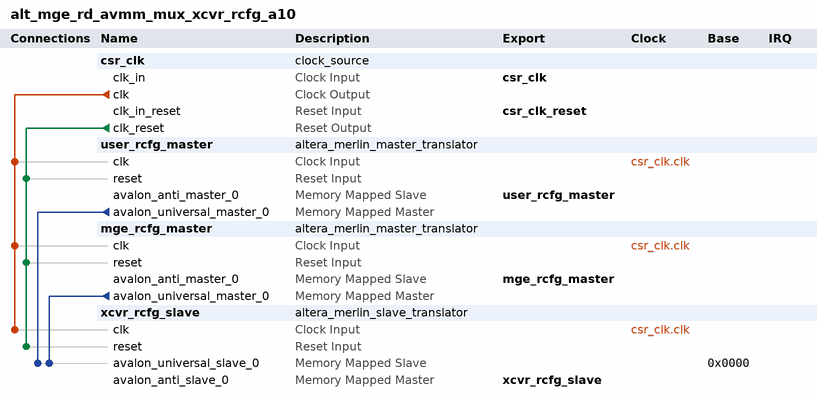
[diagram p0: system contents]
# Platform Designer (Qsys) system alt_mge_rd_avmm_mux_xcvr_rcfg_a10, Arria 10 10AX115S4F45I3SG
# Parameters at their usual value, and those the tool derives, are not listed.
package require -exact qsys 15.0
create_system alt_mge_rd_avmm_mux_xcvr_rcfg_a10
set_project_property DEVICE_FAMILY {Arria 10}
set_project_property DEVICE 10AX115S4F45I3SG

add_instance csr_clk clock_source 15.0
set_instance_parameter_value csr_clk clockFrequency 125000000

add_instance user_rcfg_master altera_merlin_master_translator 15.0
set_instance_parameter_value user_rcfg_master AV_ADDRESSGROUP 0
set_instance_parameter_value user_rcfg_master AV_ADDRESS_SYMBOLS 0
set_instance_parameter_value user_rcfg_master AV_ADDRESS_W 10
set_instance_parameter_value user_rcfg_master AV_ALWAYSBURSTMAXBURST 0
set_instance_parameter_value user_rcfg_master AV_BITS_PER_SYMBOL 8
set_instance_parameter_value user_rcfg_master AV_BURSTBOUNDARIES 0
set_instance_parameter_value user_rcfg_master AV_BURSTCOUNT_SYMBOLS 1
set_instance_parameter_value user_rcfg_master AV_BURSTCOUNT_W 3
set_instance_parameter_value user_rcfg_master AV_BYTEENABLE_W 4
set_instance_parameter_value user_rcfg_master AV_CONSTANT_BURST_BEHAVIOR 0
set_instance_parameter_value user_rcfg_master AV_DATA_HOLD 0
set_instance_parameter_value user_rcfg_master AV_DATA_W 32
set_instance_parameter_value user_rcfg_master AV_INTERLEAVEBURSTS 0
set_instance_parameter_value user_rcfg_master AV_ISBIGENDIAN 0
set_instance_parameter_value user_rcfg_master AV_LINEWRAPBURSTS 0
set_instance_parameter_value user_rcfg_master AV_MAX_PENDING_READ_TRANSACTIONS 0
set_instance_parameter_value user_rcfg_master AV_READLATENCY 0
set_instance_parameter_value user_rcfg_master AV_READ_WAIT 0
set_instance_parameter_value user_rcfg_master AV_REGISTERINCOMINGSIGNALS 0
set_instance_parameter_value user_rcfg_master AV_REGISTEROUTGOINGSIGNALS 0
set_instance_parameter_value user_rcfg_master AV_SETUP_WAIT 0
set_instance_parameter_value user_rcfg_master AV_SYMBOLS_PER_WORD 4
set_instance_parameter_value user_rcfg_master AV_WRITE_WAIT 0
set_instance_parameter_value user_rcfg_master UAV_ADDRESSGROUP 0
set_instance_parameter_value user_rcfg_master UAV_ADDRESS_W 12
set_instance_parameter_value user_rcfg_master UAV_BURSTCOUNT_W 3
set_instance_parameter_value user_rcfg_master UAV_CONSTANT_BURST_BEHAVIOR 0
set_instance_parameter_value user_rcfg_master USE_ADDRESS 1
set_instance_parameter_value user_rcfg_master USE_BEGINBURSTTRANSFER 0
set_instance_parameter_value user_rcfg_master USE_BEGINTRANSFER 0
set_instance_parameter_value user_rcfg_master USE_BURSTCOUNT 0
set_instance_parameter_value user_rcfg_master USE_BYTEENABLE 0
set_instance_parameter_value user_rcfg_master USE_CHIPSELECT 0
set_instance_parameter_value user_rcfg_master USE_CLKEN 0
set_instance_parameter_value user_rcfg_master USE_DEBUGACCESS 0
set_instance_parameter_value user_rcfg_master USE_LOCK 0
set_instance_parameter_value user_rcfg_master USE_READ 1
set_instance_parameter_value user_rcfg_master USE_READDATA 1
set_instance_parameter_value user_rcfg_master USE_READDATAVALID 0
set_instance_parameter_value user_rcfg_master USE_READRESPONSE 0
set_instance_parameter_value user_rcfg_master USE_WAITREQUEST 1
set_instance_parameter_value user_rcfg_master USE_WRITE 1
set_instance_parameter_value user_rcfg_master USE_WRITEDATA 1
set_instance_parameter_value user_rcfg_master USE_WRITERESPONSE 0

add_instance mge_rcfg_master altera_merlin_master_translator 15.0
set_instance_parameter_value mge_rcfg_master AV_ADDRESSGROUP 0
set_instance_parameter_value mge_rcfg_master AV_ADDRESS_SYMBOLS 0
set_instance_parameter_value mge_rcfg_master AV_ADDRESS_W 10
set_instance_parameter_value mge_rcfg_master AV_ALWAYSBURSTMAXBURST 0
set_instance_parameter_value mge_rcfg_master AV_BITS_PER_SYMBOL 8
set_instance_parameter_value mge_rcfg_master AV_BURSTBOUNDARIES 0
set_instance_parameter_value mge_rcfg_master AV_BURSTCOUNT_SYMBOLS 1
set_instance_parameter_value mge_rcfg_master AV_BURSTCOUNT_W 3
set_instance_parameter_value mge_rcfg_master AV_BYTEENABLE_W 4
set_instance_parameter_value mge_rcfg_master AV_CONSTANT_BURST_BEHAVIOR 0
set_instance_parameter_value mge_rcfg_master AV_DATA_HOLD 0
set_instance_parameter_value mge_rcfg_master AV_DATA_W 32
set_instance_parameter_value mge_rcfg_master AV_INTERLEAVEBURSTS 0
set_instance_parameter_value mge_rcfg_master AV_ISBIGENDIAN 0
set_instance_parameter_value mge_rcfg_master AV_LINEWRAPBURSTS 0
set_instance_parameter_value mge_rcfg_master AV_MAX_PENDING_READ_TRANSACTIONS 0
set_instance_parameter_value mge_rcfg_master AV_READLATENCY 0
set_instance_parameter_value mge_rcfg_master AV_READ_WAIT 0
set_instance_parameter_value mge_rcfg_master AV_REGISTERINCOMINGSIGNALS 0
set_instance_parameter_value mge_rcfg_master AV_REGISTEROUTGOINGSIGNALS 0
set_instance_parameter_value mge_rcfg_master AV_SETUP_WAIT 0
set_instance_parameter_value mge_rcfg_master AV_SYMBOLS_PER_WORD 4
set_instance_parameter_value mge_rcfg_master AV_WRITE_WAIT 0
set_instance_parameter_value mge_rcfg_master UAV_ADDRESSGROUP 0
set_instance_parameter_value mge_rcfg_master UAV_ADDRESS_W 12
set_instance_parameter_value mge_rcfg_master UAV_BURSTCOUNT_W 3
set_instance_parameter_value mge_rcfg_master UAV_CONSTANT_BURST_BEHAVIOR 0
set_instance_parameter_value mge_rcfg_master USE_ADDRESS 1
set_instance_parameter_value mge_rcfg_master USE_BEGINBURSTTRANSFER 0
set_instance_parameter_value mge_rcfg_master USE_BEGINTRANSFER 0
set_instance_parameter_value mge_rcfg_master USE_BURSTCOUNT 0
set_instance_parameter_value mge_rcfg_master USE_BYTEENABLE 0
set_instance_parameter_value mge_rcfg_master USE_CHIPSELECT 0
set_instance_parameter_value mge_rcfg_master USE_CLKEN 0
set_instance_parameter_value mge_rcfg_master USE_DEBUGACCESS 0
set_instance_parameter_value mge_rcfg_master USE_LOCK 0
set_instance_parameter_value mge_rcfg_master USE_READ 1
set_instance_parameter_value mge_rcfg_master USE_READDATA 1
set_instance_parameter_value mge_rcfg_master USE_READDATAVALID 0
set_instance_parameter_value mge_rcfg_master USE_READRESPONSE 0
set_instance_parameter_value mge_rcfg_master USE_WAITREQUEST 1
set_instance_parameter_value mge_rcfg_master USE_WRITE 1
set_instance_parameter_value mge_rcfg_master USE_WRITEDATA 1
set_instance_parameter_value mge_rcfg_master USE_WRITERESPONSE 0

add_instance xcvr_rcfg_slave altera_merlin_slave_translator 15.0
set_instance_parameter_value xcvr_rcfg_slave AV_ADDRESSGROUP 0
set_instance_parameter_value xcvr_rcfg_slave AV_ADDRESS_SYMBOLS 0
set_instance_parameter_value xcvr_rcfg_slave AV_ADDRESS_W 10
set_instance_parameter_value xcvr_rcfg_slave AV_ALWAYSBURSTMAXBURST 0
set_instance_parameter_value xcvr_rcfg_slave AV_BITS_PER_SYMBOL 8
set_instance_parameter_value xcvr_rcfg_slave AV_BURSTBOUNDARIES 0
set_instance_parameter_value xcvr_rcfg_slave AV_BURSTCOUNT_SYMBOLS 1
set_instance_parameter_value xcvr_rcfg_slave AV_BURSTCOUNT_W 1
set_instance_parameter_value xcvr_rcfg_slave AV_BYTEENABLE_W 4
set_instance_parameter_value xcvr_rcfg_slave AV_CONSTANT_BURST_BEHAVIOR 0
set_instance_parameter_value xcvr_rcfg_slave AV_DATA_HOLD 0
set_instance_parameter_value xcvr_rcfg_slave AV_DATA_W 32
set_instance_parameter_value xcvr_rcfg_slave AV_INTERLEAVEBURSTS 0
set_instance_parameter_value xcvr_rcfg_slave AV_ISBIGENDIAN 0
set_instance_parameter_value xcvr_rcfg_slave AV_LINEWRAPBURSTS 0
set_instance_parameter_value xcvr_rcfg_slave AV_MAX_PENDING_READ_TRANSACTIONS 1
set_instance_parameter_value xcvr_rcfg_slave AV_MAX_PENDING_WRITE_TRANSACTIONS 0
set_instance_parameter_value xcvr_rcfg_slave AV_READLATENCY 0
set_instance_parameter_value xcvr_rcfg_slave AV_READ_WAIT 0
set_instance_parameter_value xcvr_rcfg_slave AV_REGISTERINCOMINGSIGNALS 0
set_instance_parameter_value xcvr_rcfg_slave AV_REGISTEROUTGOINGSIGNALS 0
set_instance_parameter_value xcvr_rcfg_slave AV_REQUIRE_UNALIGNED_ADDRESSES 0
set_instance_parameter_value xcvr_rcfg_slave AV_SETUP_WAIT 0
set_instance_parameter_value xcvr_rcfg_slave AV_SYMBOLS_PER_WORD 4
set_instance_parameter_value xcvr_rcfg_slave AV_TIMING_UNITS 1
set_instance_parameter_value xcvr_rcfg_slave AV_WRITE_WAIT 0
set_instance_parameter_value xcvr_rcfg_slave CHIPSELECT_THROUGH_READLATENCY 0
set_instance_parameter_value xcvr_rcfg_slave CLOCK_RATE 125000000
set_instance_parameter_value xcvr_rcfg_slave UAV_ADDRESSGROUP 0
set_instance_parameter_value xcvr_rcfg_slave UAV_ADDRESS_W 12
set_instance_parameter_value xcvr_rcfg_slave UAV_BURSTCOUNT_W 3
set_instance_parameter_value xcvr_rcfg_slave UAV_BYTEENABLE_W 4
set_instance_parameter_value xcvr_rcfg_slave UAV_CONSTANT_BURST_BEHAVIOR 0
set_instance_parameter_value xcvr_rcfg_slave UAV_DATA_W 32
set_instance_parameter_value xcvr_rcfg_slave USE_ADDRESS 1
set_instance_parameter_value xcvr_rcfg_slave USE_AV_CLKEN 0
set_instance_parameter_value xcvr_rcfg_slave USE_BEGINBURSTTRANSFER 0
set_instance_parameter_value xcvr_rcfg_slave USE_BEGINTRANSFER 0
set_instance_parameter_value xcvr_rcfg_slave USE_BURSTCOUNT 0
set_instance_parameter_value xcvr_rcfg_slave USE_BYTEENABLE 0
set_instance_parameter_value xcvr_rcfg_slave USE_CHIPSELECT 0
set_instance_parameter_value xcvr_rcfg_slave USE_DEBUGACCESS 0
set_instance_parameter_value xcvr_rcfg_slave USE_LOCK 0
set_instance_parameter_value xcvr_rcfg_slave USE_OUTPUTENABLE 0
set_instance_parameter_value xcvr_rcfg_slave USE_READ 1
set_instance_parameter_value xcvr_rcfg_slave USE_READDATA 1
set_instance_parameter_value xcvr_rcfg_slave USE_READDATAVALID 0
set_instance_parameter_value xcvr_rcfg_slave USE_READRESPONSE 0
set_instance_parameter_value xcvr_rcfg_slave USE_UAV_CLKEN 0
set_instance_parameter_value xcvr_rcfg_slave USE_WAITREQUEST 1
set_instance_parameter_value xcvr_rcfg_slave USE_WRITE 1
set_instance_parameter_value xcvr_rcfg_slave USE_WRITEBYTEENABLE 0
set_instance_parameter_value xcvr_rcfg_slave USE_WRITEDATA 1
set_instance_parameter_value xcvr_rcfg_slave USE_WRITERESPONSE 0

# connections
add_connection csr_clk.clk mge_rcfg_master.clk clock
add_connection csr_clk.clk user_rcfg_master.clk clock
add_connection csr_clk.clk xcvr_rcfg_slave.clk clock
add_connection csr_clk.clk_reset mge_rcfg_master.reset reset
add_connection csr_clk.clk_reset user_rcfg_master.reset reset
add_connection csr_clk.clk_reset xcvr_rcfg_slave.reset reset
add_connection mge_rcfg_master.avalon_universal_master_0 xcvr_rcfg_slave.avalon_universal_slave_0 avalon
set_connection_parameter_value mge_rcfg_master.avalon_universal_master_0/xcvr_rcfg_slave.avalon_universal_slave_0 baseAddress 0x0000
add_connection user_rcfg_master.avalon_universal_master_0 xcvr_rcfg_slave.avalon_universal_slave_0 avalon
set_connection_parameter_value user_rcfg_master.avalon_universal_master_0/xcvr_rcfg_slave.avalon_universal_slave_0 baseAddress 0x0000

# exported interfaces
add_interface csr_clk clock sink
set_interface_property csr_clk EXPORT_OF csr_clk.clk_in
add_interface csr_clk_reset reset sink
set_interface_property csr_clk_reset EXPORT_OF csr_clk.clk_in_reset
add_interface mge_rcfg_master avalon slave
set_interface_property mge_rcfg_master EXPORT_OF mge_rcfg_master.avalon_anti_master_0
add_interface user_rcfg_master avalon slave
set_interface_property user_rcfg_master EXPORT_OF user_rcfg_master.avalon_anti_master_0
add_interface xcvr_rcfg_slave avalon master
set_interface_property xcvr_rcfg_slave EXPORT_OF xcvr_rcfg_slave.avalon_anti_slave_0

set_interconnect_requirement {$system} qsys_mm.clockCrossingAdapter HANDSHAKE
set_interconnect_requirement {$system} qsys_mm.maxAdditionalLatency 1

save_system alt_mge_rd_avmm_mux_xcvr_rcfg_a10.qsys
